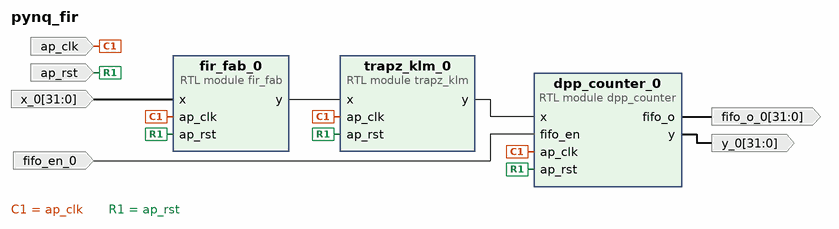
[diagram p0: block diagram of the top level]
# Vivado block design pynq_fir, xc7z020clg400-1, Vivado 2022.2
create_bd_design pynq_fir

create_bd_port -dir I -type rst ap_rst
create_bd_port -dir I -type clk ap_clk
create_bd_port -dir I -from 31 -to 0 x_0
create_bd_port -dir O -from 31 -to 0 y_0
create_bd_port -dir I fifo_en_0
create_bd_port -dir O -from 31 -to 0 fifo_o_0

create_bd_cell -type module -reference fir_fab fir_fab_0
create_bd_cell -type module -reference dpp_counter dpp_counter_0
create_bd_cell -type module -reference trapz_klm trapz_klm_0

# ---- connections ----

connect_bd_net -net ap_clk_0_1 [get_bd_ports ap_clk] \
  [get_bd_pins fir_fab_0/ap_clk] [get_bd_pins dpp_counter_0/ap_clk] [get_bd_pins trapz_klm_0/ap_clk]
connect_bd_net -net ap_rst_0_1 [get_bd_ports ap_rst] \
  [get_bd_pins fir_fab_0/ap_rst] [get_bd_pins dpp_counter_0/ap_rst] [get_bd_pins trapz_klm_0/ap_rst]
connect_bd_net [get_bd_pins dpp_counter_0/fifo_o] [get_bd_ports fifo_o_0]
connect_bd_net [get_bd_pins dpp_counter_0/y] [get_bd_ports y_0]
connect_bd_net -net fifo_en_0_1 [get_bd_ports fifo_en_0] [get_bd_pins dpp_counter_0/fifo_en]
connect_bd_net [get_bd_pins fir_fab_0/y] [get_bd_pins trapz_klm_0/x]
connect_bd_net [get_bd_pins trapz_klm_0/y] [get_bd_pins dpp_counter_0/x]
connect_bd_net -net x_0_1 [get_bd_ports x_0] [get_bd_pins fir_fab_0/x]

validate_bd_design
save_bd_design
